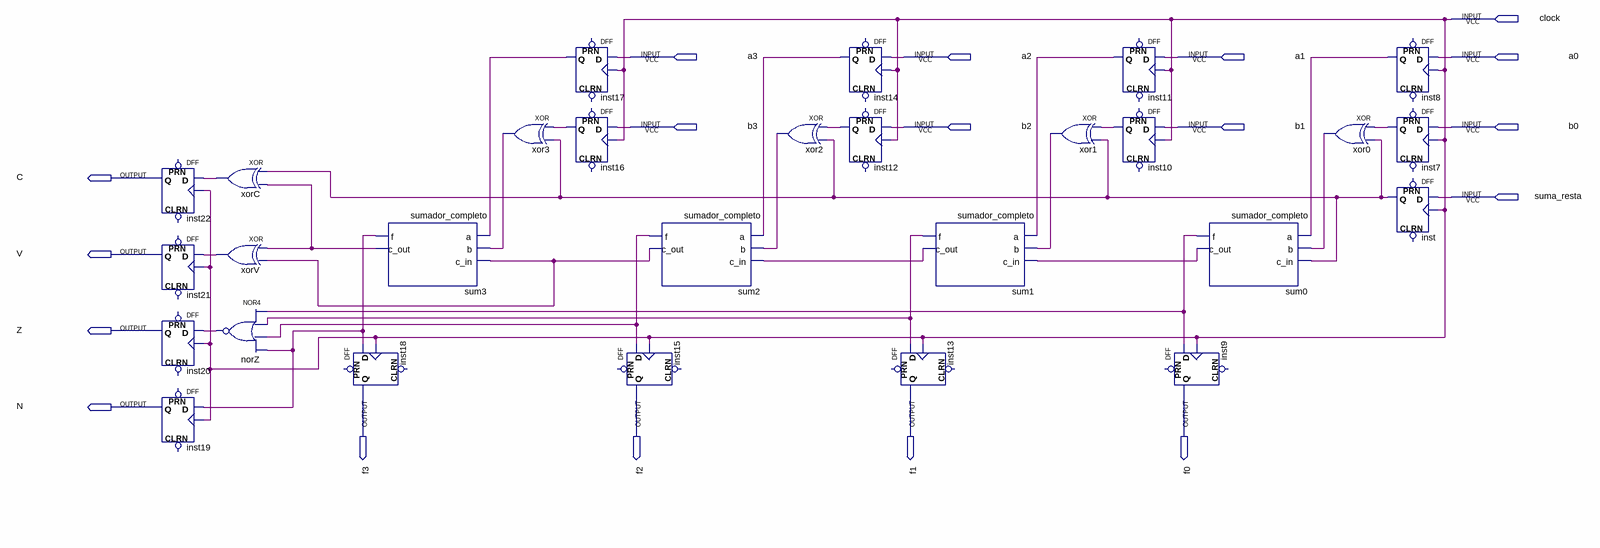
[diagram p0: schematic sheet]
// Quartus schematic Sumador_restador.bdf as structural Verilog: 28 symbols, 18 pins
module Sumador_restador (
  input  clock,
  input  a3,
  input  a2,
  input  a1,
  input  a0,
  input  b3,
  input  b2,
  input  b1,
  input  b0,
  input  suma_resta,
  output C,
  output V,
  output Z,
  output f3,
  output f2,
  output f1,
  output f0,
  output N
);

  wire inst7_q, inst8_q, inst10_q, inst11_q, inst12_q, inst14_q, inst16_q, inst17_q, inst_q, norZ_out,
       sum0_c_out, sum0_f, sum1_c_out, sum1_f, sum2_c_out, sum2_f, sum3_c_out, sum3_f, xor0_out, xor1_out,
       xor2_out, xor3_out, xorC_out, xorV_out;

  DFF inst22 (.CLK(clock), .D(xorC_out), .Q(C));  // open: CLRN, PRN
  DFF inst21 (.CLK(clock), .D(xorV_out), .Q(V));  // open: CLRN, PRN
  DFF inst20 (.CLK(clock), .D(norZ_out), .Q(Z));  // open: CLRN, PRN
  DFF inst19 (.CLK(clock), .D(sum3_f), .Q(N));  // open: CLRN, PRN
  xor xorC (xorC_out, inst_q, sum3_c_out);
  xor xorV (xorV_out, sum3_c_out, sum2_c_out);
  nor norZ (norZ_out, sum0_f, sum1_f, sum2_f, sum3_f);
  DFF inst18 (.CLK(clock), .D(sum3_f), .Q(f3));  // open: CLRN, PRN
  sumador_completo sum3 (.a(inst17_q), .b(xor3_out), .c_in(sum2_c_out), .f(sum3_f), .c_out(sum3_c_out));
  xor xor3 (xor3_out, inst16_q, inst_q);
  DFF inst17 (.CLK(clock), .D(a3), .Q(inst17_q));  // open: CLRN, PRN
  DFF inst16 (.CLK(clock), .D(b3), .Q(inst16_q));  // open: CLRN, PRN
  DFF inst15 (.CLK(clock), .D(sum2_f), .Q(f2));  // open: CLRN, PRN
  sumador_completo sum2 (.a(inst14_q), .b(xor2_out), .c_in(sum1_c_out), .f(sum2_f), .c_out(sum2_c_out));
  xor xor2 (xor2_out, inst12_q, inst_q);
  DFF inst14 (.CLK(clock), .D(a2), .Q(inst14_q));  // open: CLRN, PRN
  DFF inst12 (.CLK(clock), .D(b2), .Q(inst12_q));  // open: CLRN, PRN
  sumador_completo sum1 (.a(inst11_q), .b(xor1_out), .c_in(sum0_c_out), .f(sum1_f), .c_out(sum1_c_out));
  DFF inst13 (.CLK(clock), .D(sum1_f), .Q(f1));  // open: CLRN, PRN
  xor xor1 (xor1_out, inst10_q, inst_q);
  DFF inst11 (.CLK(clock), .D(a1), .Q(inst11_q));  // open: CLRN, PRN
  DFF inst10 (.CLK(clock), .D(b1), .Q(inst10_q));  // open: CLRN, PRN
  DFF inst9 (.CLK(clock), .D(sum0_f), .Q(f0));  // open: CLRN, PRN
  sumador_completo sum0 (.a(inst8_q), .b(xor0_out), .c_in(inst_q), .f(sum0_f), .c_out(sum0_c_out));
  xor xor0 (xor0_out, inst7_q, inst_q);
  DFF inst8 (.CLK(clock), .D(a0), .Q(inst8_q));  // open: CLRN, PRN
  DFF inst7 (.CLK(clock), .D(b0), .Q(inst7_q));  // open: CLRN, PRN
  DFF inst (.CLK(clock), .D(suma_resta), .Q(inst_q));  // open: CLRN, PRN
endmodule
